# Altium schematic sheet Sheet3.SchDoc
size B
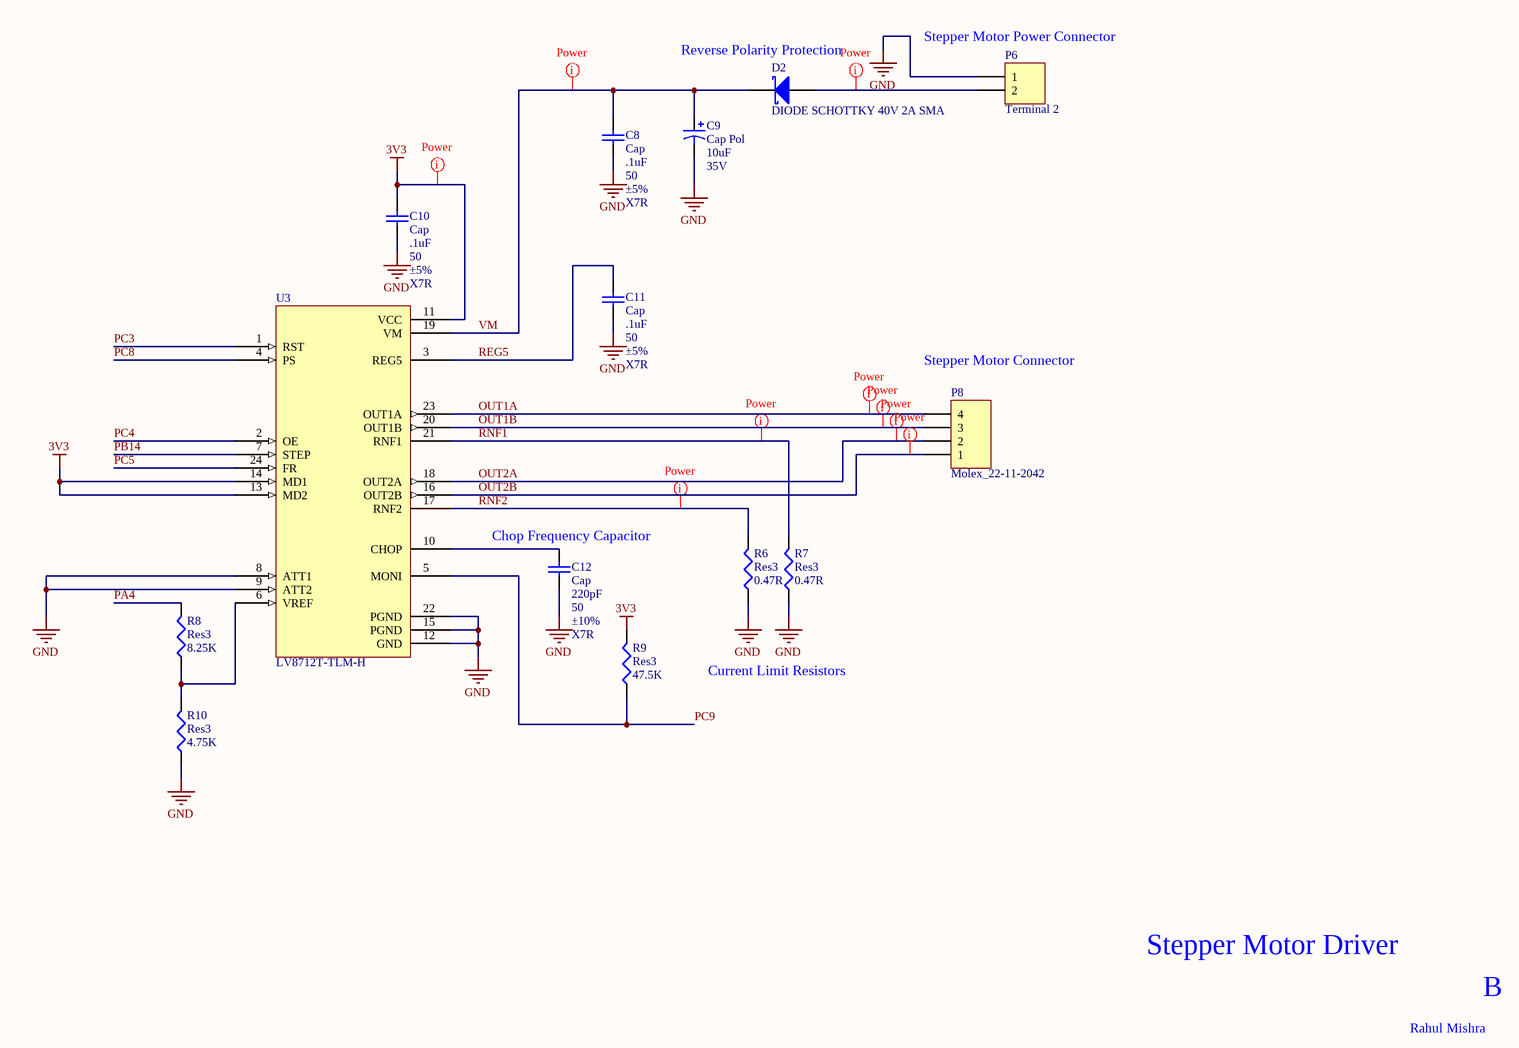
[diagram p0: Sheet3.SchDoc]

## Parts
C8  Cap  value .1uF  WV: 50  Tolerance: ±5%  Type: X7R  [CAPC2012X09M]
C9  Cap Pol  value 10uF  Voltage: 35V  [CAPACITOR_5MM]
C10  Cap  value .1uF  WV: 50  Tolerance: ±5%  Type: X7R  [CAPC2012X09M]
C11  Cap  value .1uF  WV: 50  Tolerance: ±5%  Type: X7R  [CAPC2012X09M]
C12  Cap  value 220pF  WV: 50  Tolerance: ±10%  Type: X7R  [CAPC2012X09M]
D2  DIODE SCHOTTKY 40V 2A SMA  [DIOM4326X23M]
P6  Terminal 2  [TYCO_282841_2]
P8  Molex_22-11-2042  [MOLEX-22-11-2042]
R6  Res3  value 0.47R  [RESC3125X07M]
R7  Res3  value 0.47R  [RESC3125X07M]
R8  Res3  value 8.25K  [RESC2112X05M]
R9  Res3  value 47.5K  [RESC2112X05M]
R10  Res3  value 4.75K  [RESC2112X05M]
U3  LV8712T-TLM-H  [ONSEMITSSOP50P640X120-24M]

## Nets
3V3: C10.2 R9.2 U3.11(VCC) U3.13(MD2) U3.14(MD1)
GND: C8.1 C9.2 C10.1 C11.1 C12.1 P6.1 R6.1 R7.1 R10.1 U3.8(ATT1) U3.9(ATT2) U3.12(GND) U3.15(PGND) U3.22(PGND)
OUT1A: P8.4 U3.23(OUT1A)
OUT1B: P8.3 U3.20(OUT1B)
OUT2A: P8.2 U3.18(OUT2A)
OUT2B: P8.1 U3.16(OUT2B)
PA4: R8.2
PB14: U3.7(STEP)
PC3: U3.1(RST)
PC4: U3.2(OE)
PC5: U3.24(FR)
PC8: U3.4(PS)
PC9: R9.1 U3.5(MONI)
REG5: C11.2 U3.3(REG5)
RNF1: R7.2 U3.21(RNF1)
RNF2: R6.2 U3.17(RNF2)
VM: C8.2 C9.1 D2.1(K) U3.19(VM)
NetC12_2: C12.2 U3.10(CHOP)
NetD2_2: D2.2(A) P6.2
NetR8_1: R8.1 R10.2 U3.6(VREF)

## Layout directives
net class Power: 3V3, NetD2_2, OUT1A, OUT1B, OUT2A, OUT2B, RNF1, RNF2, VM

## Notes on the sheet
- (near D2) Reverse Polarity Protection
- (near P6) Stepper Motor Power Connector
- (near P8) Stepper Motor Connector
- (near C12) Chop Frequency Capacitor
- Current Limit Resistors
- Stepper Motor Driver
- B
- Rahul Mishra

## Library data of the parts
C8 C10 C11 = CAP-X7R-.1uF-50V-±5%: CAP CER .1uF 50v X7R 0805; MPN: C0805C104J5RACTU; PN: 399-1171-1-ND; Name: CAP-X7R-.1uF-50V-±5%; URL: http://www.digikey.ca/product-detail/en/C0805C104J5RACTU/399-1171-1-ND
C9 = Cap Polar-10uF-35V: CAP 85C 10uF ±20% 35V WX Series Aluminum Electrolytic; MPN: UWX1V100MCL1GB; Tan Theta: 0.12; Leakage Current: 3.5; Rated Ripple Current: 29; PN: 493-2117-1-ND; Name: Cap Polar-10uF-35V; Diameter: 5; URL: http://www.digikey.ca/product-detail/en/UWX1V100MCL1GB/493-2117-1-ND
C12 = CAP-X7R-220pF-50V-±10%: CAP CER 220pF 50v X7R 0805; MPN: C0805C221K5RACTU; PN: 399-1138-1-ND; Name: CAP-X7R-220pF-50V-±10%; URL: http://www.digikey.ca/product-detail/en/C0805C221K5RACTU/399-1138-1-ND
D2 = DIODE SCHOTTKY 40V 2A SMA: Schottky Rectifier; MPN: B240A-13-F; PN: B240A-FDICT-ND; URL: http://www.digikey.ca/product-detail/en/B240A-13-F/B240A-FDICT-ND
P6 = Terminal 2: Terminal, 2-Pin; MPN: 282841-2; PN: A98342-ND; LatestRevisionDate: 17-Jul-2002; LatestRevisionNote: Re-released for DXP Platform.; Publisher: Altium Limited; URL: http://www.digikey.ca/product-detail/en/282841-2/A98342-ND/1136740
P8 = Molex_22-11-2042: CONN HEADER 4POS .100 VERT GOLD; MPN: 0022112042; PN: WM2702-ND; URL: http://www.digikey.ca/product-detail/en/0022112042/WM2702-ND
R6 R7 = Resistor_0.47R_1W: RES SMD 0.47OHM 5% 1W 1210; MPN: RCWE1210R470FKEA; PN: RCWE.47FCT-ND; Name: Resistor_0.47R_1W; URL: http://www.digikey.ca/product-detail/en/vishay-dale/RCWE1210R470FKEA/RCWE.47FCT-ND
R8 = Resistor_8.25K: RES SMD 8.25K OHM 1% 1/8W 0805; MPN: CRCW08058K25FKEA; PN: 541-8.25KCCT-ND; Name: Resistor_8.25K; URL: http://www.digikey.ca/product-detail/en/CRCW08058K25FKEA/541-8.25KCCT-ND
R9 = Resistor_47.5K: RES SMD 47.5K OHM 1% 1/8W 0805; MPN: CRCW080547K5FKEA; PN: 541-47.5KCCT-ND; Name: Resistor_47.5K; URL: http://www.digikey.ca/product-detail/en/CRCW080547K5FKEA/541-47.5KCCT-ND
R10 = Resistor_4.75K: RES SMD 4.75K OHM 1% 1/8W 0805; MPN: CRCW08054K75FKEA; PN: 541-4.75KCCT-ND; Name: Resistor_4.75K; URL: http://www.digikey.ca/product-detail/en/CRCW08054K75FKEA/541-4.75KCCT-ND
U3 = LV8712T-TLM-H: IC MOTOR DRIVER PAR 24TSSOP; PN: 869-1290-1-ND; URL: http://www.digikey.ca/product-detail/en/on-semiconductor/LV8712T-TLM-H/869-1290-1-ND; MPN: LV8712T-TLM-H